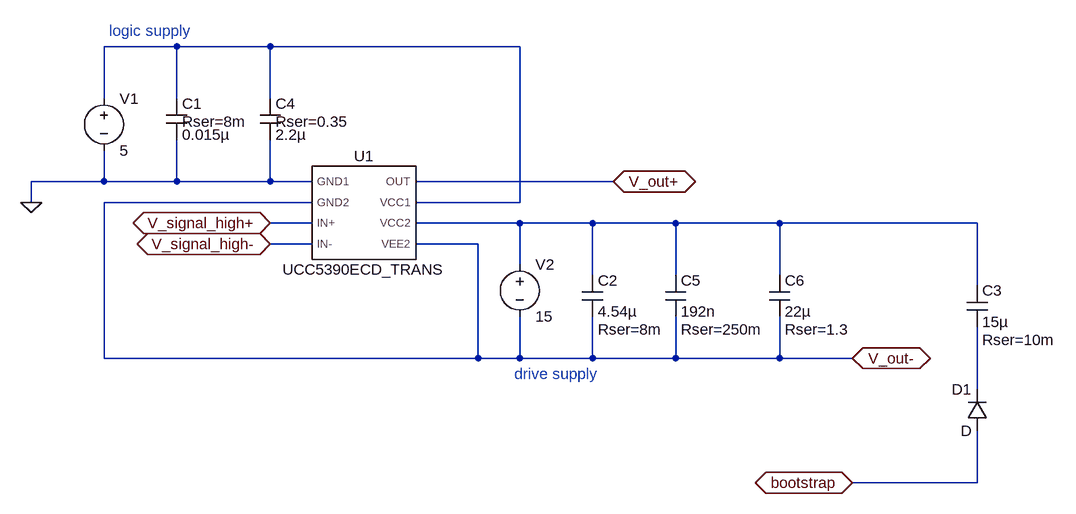
[diagram p0: schematic GateDriverHigh.asc]
GateDriverHigh.asc, the LTspice schematic file:
Version 4.1
SHEET 1 1284 1192
WIRE -80 -128 -192 -128
WIRE 64 -128 -80 -128
WIRE 448 -128 64 -128
WIRE -192 -48 -192 -128
WIRE -80 -48 -80 -128
WIRE 64 -48 64 -128
WIRE -192 80 -192 32
WIRE -192 80 -304 80
WIRE -80 80 -80 16
WIRE -80 80 -192 80
WIRE 64 80 64 16
WIRE 64 80 -80 80
WIRE 128 80 64 80
WIRE 592 80 288 80
WIRE -304 112 -304 80
WIRE 128 112 -192 112
WIRE 448 112 448 -128
WIRE 448 112 288 112
WIRE 128 144 64 144
WIRE 448 144 288 144
WIRE 560 144 448 144
WIRE 688 144 560 144
WIRE 848 144 688 144
WIRE 1152 144 848 144
WIRE 128 176 64 176
WIRE 384 176 288 176
WIRE 448 208 448 144
WIRE 560 224 560 144
WIRE 688 224 688 144
WIRE 848 224 848 144
WIRE 1152 240 1152 144
WIRE -192 352 -192 112
WIRE 384 352 384 176
WIRE 384 352 -192 352
WIRE 448 352 448 288
WIRE 448 352 384 352
WIRE 560 352 560 288
WIRE 560 352 448 352
WIRE 688 352 688 288
WIRE 688 352 560 352
WIRE 848 352 848 288
WIRE 848 352 688 352
WIRE 960 352 848 352
WIRE 1152 400 1152 304
WIRE 1152 544 1152 464
WIRE 1152 544 960 544
FLAG 592 80 V_out+
IOPIN 592 80 BiDir
FLAG 64 144 V_signal_high+
IOPIN 64 144 BiDir
FLAG 64 176 V_signal_high-
IOPIN 64 176 BiDir
FLAG 960 352 V_out-
IOPIN 960 352 BiDir
FLAG -304 112 0
FLAG 960 544 bootstrap
IOPIN 960 544 BiDir
SYMBOL UCC5390ECD_TRANS 208 128 R0
SYMATTR InstName U1
SYMBOL voltage -192 -64 R0
WINDOW 123 0 0 Left 0
WINDOW 39 0 0 Left 0
SYMATTR InstName V1
SYMATTR Value 5
SYMBOL cap -96 -48 R0
WINDOW 39 24 36 Left 2
SYMATTR SpiceLine Rser=8m
SYMATTR InstName C1
SYMATTR Value 0.015µ
SYMBOL voltage 448 192 R0
WINDOW 123 0 0 Left 0
WINDOW 39 0 0 Left 0
SYMATTR InstName V2
SYMATTR Value 15
SYMBOL cap 544 224 R0
WINDOW 39 24 84 Left 2
SYMATTR SpiceLine Rser=8m
SYMATTR InstName C2
SYMATTR Value 4.54µ
SYMBOL cap 1136 240 R0
WINDOW 39 24 84 Left 2
SYMATTR SpiceLine Rser=10m
SYMATTR InstName C3
SYMATTR Value 15µ
SYMBOL diode 1168 464 R180
WINDOW 0 24 64 Left 2
WINDOW 3 24 0 Left 2
SYMATTR InstName D1
SYMBOL cap 48 -48 R0
WINDOW 39 24 36 Left 2
SYMATTR SpiceLine Rser=0.35
SYMATTR InstName C4
SYMATTR Value 2.2µ
SYMBOL cap 672 224 R0
WINDOW 39 24 84 Left 2
SYMATTR SpiceLine Rser=250m
SYMATTR InstName C5
SYMATTR Value 192n
SYMBOL cap 832 224 R0
WINDOW 39 24 84 Left 2
SYMATTR SpiceLine Rser=1.3
SYMATTR InstName C6
SYMATTR Value 22µ
TEXT -184 -152 Left 2 ;logic supply
TEXT 440 376 Left 2 ;drive supply

The netlist it stands for:
* GateDriverHigh.asc
X§U1 0 V_out- V_signal_high+ V_signal_high- V_out+ N001 N002 V_out- UCC5390ECD_TRANS  ; pins GND1 GND2 IN+ IN- OUT VCC1 VCC2 VEE2
V1 N001 0 5
C1 N001 0 0.015µ Rser=8m
V2 N002 V_out- 15
C2 N002 V_out- 4.54µ Rser=8m
C3 N002 N003 15µ Rser=10m
D1 bootstrap N003 D
C4 N001 0 2.2µ Rser=0.35
C5 N002 V_out- 192n Rser=250m
C6 N002 V_out- 22µ Rser=1.3
.model D D
.lib standard.dio
* logic supply
* drive supply
.lib UCC5390ECD_TRANS.LIB
.backanno
.end